# EasyEDA Pro project FPGA_oscilloscope Analog pre circuit PCB.epro

# Schematic Schematic1
Create Date: 2024-04-10; Page Name: P1; Project Name: 示波器前置电路; Schematic Name: Schematic1; Update Date: 2024-04-10; Company: 嘉立创EDA; Page Size: A4; Version: V1.0
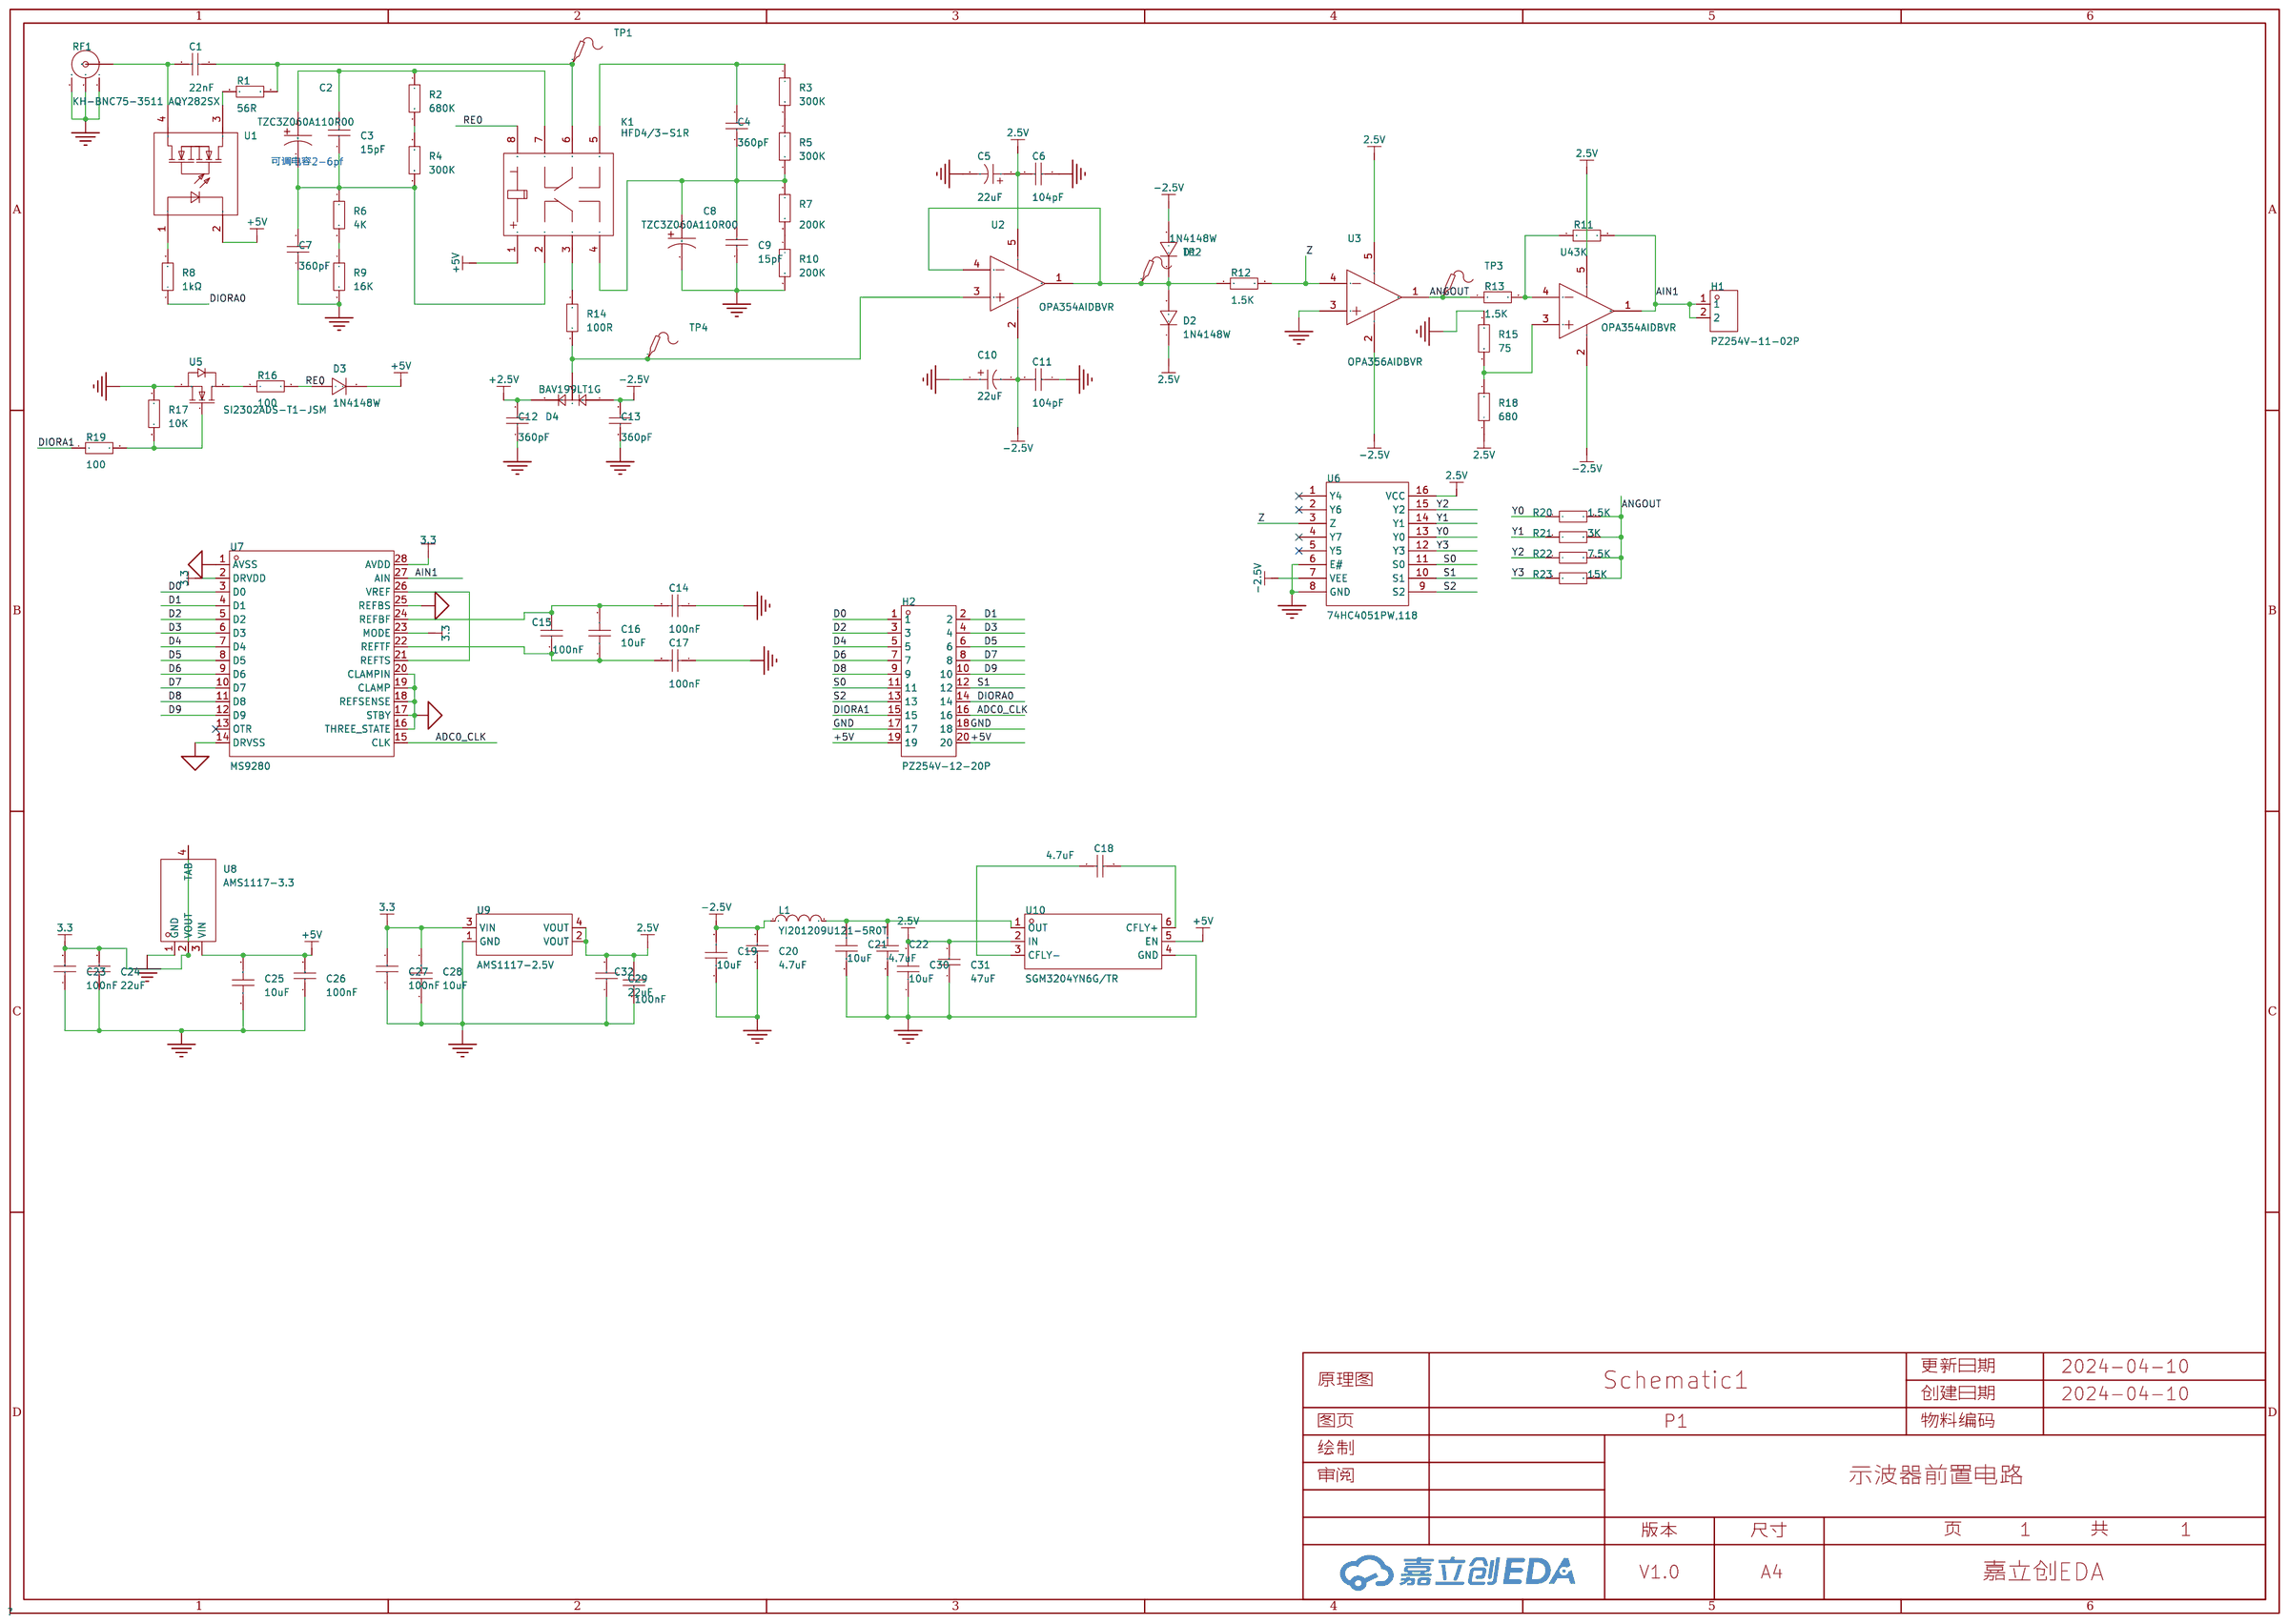
[diagram p0: schematic sheet]

## Parts
C1  22nF  [C1206]
C2  TZC3Z060A110R00  [CAP-SMD_L4.50-W3.20]
C3  15pF  [C0805]
C4  360pF  [C0805]
C5  22uF  [CAP-SMD_BD4.0-L4.3-W4.3-FD-A]
C6  104pF  [C0805]
C7  360pF  [C0805]
C8  TZC3Z060A110R00  [CAP-SMD_L4.50-W3.20]
C9  15pF  [C0805]
C10  22uF  [CAP-SMD_BD4.0-L4.3-W4.3-FD-A]
C11  104pF  [C0805]
C12  360pF  [C0805]
C13  360pF  [C0805]
C14  100nF  [C0805]
C15  100nF  [C0805]
C16  10uF  [C0805]
C17  100nF  [C0805]
C18  4.7uF  [C0805]
C19  10uF  [C0805]
C20  4.7uF  [C0805]
C21  10uF  [C0805]
C22  4.7uF  [C0805]
C23  100nF  [C0805]
C24  22uF  [C0805]
C25  10uF  [C0805]
C26  100nF  [C0805]
C27  100nF  [C0805]
C28  10uF  [C0805]
C29  22uF  [C0805]
C30  10uF  [C0805]
C31  47uF  [C0805]
C32  100nF  [C0805]
D1  1N4148W  [SOD-123_L2.8-W1.8-LS3.7-RD]
D2  1N4148W  [SOD-123_L2.8-W1.8-LS3.7-RD]
D3  1N4148W  [SOD-123_L2.8-W1.8-LS3.7-RD]
D4  BAV199LT1G  [SOT-23_L2.9-W1.3-P1.90-LS2.4-BR]
H1  PZ254V-11-02P  [HDR-TH_2P-P2.54-V-M]
H2  PZ254V-12-20P  [HDR-TH_20P-P2.54-V-M-R2-C10-S2.54]
K1  HFD4/3-S1R  [RELAY-SMD_HFD4-3-S1R]
L1  YI201209U121-5R0T  [L0805]
R1  56R  [R0805]
R2  680K  [R0805]
R3  47K  [R0805]
R4  300K  [R0805]
R5  300K  [R0805]
R6  47K  [R0805]
R7  200K  [R0805]
R8  1kΩ  [R0805]
R9  47K  [R0805]
R10  200K  [R0805]
R11  3K  [R0805]
R12  1.5K  [R0805]
R13  1.5K  [R0805]
R14  100R  [R0805]
R15  75  [R0805]
R16  47K  [R0805]
R17  47K  [R0805]
R18  680  [R0805]
R19  47K  [R0805]
R20  1.5K  [R0805]
R21  3K  [R0805]
R22  7.5K  [R0805]
R23  15K  [R0805]
RF1  KH-BNC75-3511  [ANT-TH_KH-BNC75-3511]
TP1  -  [Test-Point-0.5mm]
TP2  -  [Test-Point-0.5mm]
TP3  -  [Test-Point-0.5mm]
TP4  -  [Test-Point-0.5mm]
U1  AQY282SX  [SOP-4_L4.3-W4.4-P2.54-LS7.0-BL]
U2  OPA354AIDBVR  [SOT-23-5_L3.0-W1.7-P0.95-LS2.8-BR]
U3  OPA356AIDBVR  [SOT-23-5_L3.0-W1.7-P0.95-LS2.8-BR]
U4  OPA354AIDBVR  [SOT-23-5_L3.0-W1.7-P0.95-LS2.8-BR]
U5  SI2302ADS-T1-JSM  [SOT-23-3_L2.9-W1.3-P1.90-LS2.4-BR]
U6  74HC4051PW,118  [TSSOP-16_L5.0-W4.4-P0.65-LS6.4-BL]
U7  MS9280  [SSOP-28_L10.2-W5.3-P0.65-LS7.8-BL]
U8  AMS1117-3.3  [SOT-223-3_L6.5-W3.5-P3.05-LS7.0]
U9  AMS1117-2.5V  [SOT-223_L6.5-W3.5-P2.30-LS7.0-BR]
U10  SGM3204YN6G/TR  [SOT-23-6_L2.9-W1.6-P0.95-LS2.8-BR]

## Library data of the parts
C1 = GRM3195C1H223JA01D: 容值:22nF;精度:±5%;额定电压:50V;材质(温度系数):C0G;; LCSC Part Name: 22nF ±5% 50V; Supplier Part: C97929; Manufacturer: muRata(村田); Supplier Footprint: 1206; JLCPCB Part Class: 扩展库; Datasheet: https://atta.szlcsc.com/upload/public/pdf/source/20180228/C97929_15198056796321377690.pdf; Supplier: LCSC; Tolerance: ±5%; Voltage Rated: 50V; Temperature Coefficient: C0G
C2 C8 = TZC3Z060A110R00: 静电容量:2pF~6pF;静电容量公差:0%~+50%;额定电压(Vdc):100V;Q值:500@1MHz;; LCSC Part Name: 2pF~6pF 100V; Supplier Part: C98107; Manufacturer: muRata(村田); Supplier Footprint: SMD,4.5x3.2mm; JLCPCB Part Class: 扩展库; Datasheet: https://atta.szlcsc.com/upload/public/pdf/source/20190613/C98107_4E252F435657FA4638F4846F0BD190EF.pdf; Supplier: LCSC; electrostatic capacity: 2pF~6pF; Tolerance: 0%~+50%; Rated Voltage: 100V; Q @ Freq: 500@1MHz; Operating Temperature: -25℃~+85℃
C3 C4 C6 C7 C9 C11-C13 = CL21B105KBFNNNE: 容值:1uF;精度:±10%;额定电压:50V;材质(温度系数):X7R;; LCSC Part Name: 1uF ±10% 50V; Supplier Part: C28323; Manufacturer: SAMSUNG(三星); Supplier Footprint: 0805; JLCPCB Part Class: 基础库; Datasheet: https://atta.szlcsc.com/upload/public/pdf/source/20160218/1457707763339.pdf; Supplier: LCSC; Tolerance: ±10%; Voltage Rated: 50V; Temperature Coefficient: X7R
C5 C10 = RVT22UF16V67RV0017: 容值:22uF;精度:±20%;额定电压:16V;纹波电流:21mA@120Hz;等效串联电阻:-;; LCSC Part Name: 22uF ±20% 16V; Supplier Part: C2895280; Manufacturer: KNSCHA(科尼盛); Supplier Footprint: SMD,D4xL5.4mm; JLCPCB Part Class: 扩展库; Datasheet: https://atta.szlcsc.com/upload/public/pdf/source/20210913/F3045483CFF837C1D63EB135475AA9CE.pdf; Supplier: LCSC; Tolerance: ±20%; Rated Voltage: 16V; Ripple Current: 21mA@120Hz; φD: 4mm; L: 5.4mm; Lifetime @ Temp: 2000hrs@105℃; Operating Temperature: -55℃~+105℃
C14 C15 C17 C18 C20 C23 C24 C26 C27 C29 C31 C32 = 0805B104K500NT: 容值:100nF;精度:±10%;额定电压:50V;材质(温度系数):X7R;; LCSC Part Name: 100nF ±10% 50V; Supplier Part: C38141; Manufacturer: FH(风华); Supplier Footprint: 0805; JLCPCB Part Class: 扩展库; Datasheet: https://atta.szlcsc.com/upload/public/pdf/source/20200305/C486355_26A10D38EF8C2A5C37091D0039909270.pdf; Supplier: LCSC; Tolerance: ±10%; Voltage Rated: 50V; Temperature Coefficient: X7R
C16 C19 C21 C22 C25 C28 C30 = CL21A106KAYNNNE_C15850: 容值:10uF;精度:±10%;额定电压:25V;材质(温度系数):X5R;; LCSC Part Name: 10uF ±10% 25V; Supplier Part: C15850; Manufacturer: SAMSUNG(三星); Manufacturer Part: CL21A106KAYNNNE; Supplier Footprint: 0805; JLCPCB Part Class: 基础库; Datasheet: https://atta.szlcsc.com/upload/public/pdf/source/20160218/1457707763339.pdf; Supplier: LCSC; Tolerance: ±10%; Voltage Rated: 25V; Temperature Coefficient: X5R
D1-D3 = 1N4148W_C2099: 二极管配置:独立式;正向压降(Vf):1.25V@150mA;直流反向耐压(Vr):100V;平均整流电流(Io):150mA;功率:500mW;反向恢复时间(trr):4ns;; LCSC Part Name: 电压:100V 电流:150mA; Supplier Part: C2099; Manufacturer: CJ(江苏长电/长晶); Supplier Footprint: SOD-123; JLCPCB Part Class: 扩展库; Datasheet: https://atta.szlcsc.com/upload/public/pdf/source/20120428/1457706480199.pdf; Supplier: LCSC; Diode Configuration: 独立式; Forward Voltage (Vf@If): 1.25V@150mA; Reverse Voltage (Vr): 100V; Average Rectified Current (Io): 150mA; Power Dissipation: 500mW; Reverse Leakage Current: 1uA@75V; Reverse Recovery Time (trr): 4ns
D4 = BAV199LT1G: 二极管配置:1对串联式;正向压降(Vf):1.25V@150mA;直流反向耐压(Vr):70V;平均整流电流(Io):215mA;; LCSC Part Name: 电压:70V 电流:215mA; Supplier Part: C145516; Manufacturer: onsemi(安森美); Supplier Footprint: SOT-23; JLCPCB Part Class: 扩展库; Datasheet: https://atta.szlcsc.com/upload/public/pdf/source/20180112/C145516_15157255405661261285.PDF; Supplier: LCSC; Diode Configuration: 1对串联式; Forward Voltage (Vf@If): 1.25V@150mA; Reverse Voltage (Vr): 70V; Average Rectified Current (Io): 215mA; Reverse Leakage Current: 5uA@70V
H1 = PZ254V-11-02P: 插针结构:1x2P;间距:2.54mm;行距:-;圆针/方针:方针;安装类型:直插;排数:单排;总PIN位数:2P;额定电流:-;额定电压:-;配合针长度:6mm;塑高:2.5mm;端接针长度:3mm;触头材质:黄铜;触头镀层:-;工作温度范围:-40℃~+105℃;颜色:黑色;; LCSC Part Name: 间距:2.54mm 1x2P 直插 方针; Supplier Part: C492401; Manufacturer: XFCN(兴飞); Supplier Footprint: 插件,P=2.54mm; JLCPCB Part Class: 扩展库; Datasheet: https://atta.szlcsc.com/upload/public/pdf/source/20200309/C492401_A812433581A9B211A7FFA413ADDFF0E5.pdf; Supplier: LCSC; Pin Structure: 1x2P; Pitch: 2.54mm; Circluar Pins/Square Pins: 方针; Mounting Type: 直插; Number of Rows: 单排; Number of Pins: 2P; Length of Mating Pin: 6mm; Insulation Height: 2.5mm; Length of End Connection Pin: 3mm; Contact Material: 黄铜; Operating Temperature Range: -40℃~+105℃; Color: 黑色
H2 = PZ254V-12-20P: 插针结构:2x10P;间距:2.54mm;行距:2.54mm;圆针/方针:方针;安装类型:直插;排数:双排;总PIN位数:20P;额定电流:-;额定电压:-;配合针长度:6mm;塑高:2.5mm;端接针长度:3mm;触头材质:黄铜;触头镀层:-;工作温度范围:-40℃~+105℃;颜色:黑色;; LCSC Part Name: 间距:2.54mm 2x10P 直插 方针; Supplier Part: C492427; Manufacturer: XFCN(兴飞); Supplier Footprint: 插件,P=2.54mm; JLCPCB Part Class: 扩展库; Datasheet: https://atta.szlcsc.com/upload/public/pdf/source/20200309/C492427_9411E93D35F2EC20CED9A3ED9F4BBE60.pdf; Supplier: LCSC; Pin Structure: 2x10P; Pitch: 2.54mm; Row Spacing: 2.54mm; Circluar Pins/Square Pins: 方针; Mounting Type: 直插; Number of Rows: 双排; Number of Pins: 20P; Length of Mating Pin: 6mm; Insulation Height: 2.5mm; Length of End Connection Pin: 3mm; Contact Material: 黄铜; Operating Temperature Range: -40℃~+105℃; Color: 黑色
K1 = HFD4/3-S1R: 线圈电压:3V;触点形式:两组转换:2C(双刀双掷-转换);触点容量(电阻负载):1A@30VDC；300mA@125VAC;最大切换电压:250V@AC；220V@DC;最大切换电流:2A;; LCSC Part Name: 超小型3V继电器 双刀双掷; Supplier Part: C143232; Manufacturer: HF(宏发); Supplier Footprint: SMD,6.5x10mm; JLCPCB Part Class: 扩展库; Supplier: LCSC; Coil Voltage: 3V; Contact Form: 两组转换:2C(双刀双掷-转换); Pin Number: 8; Contact Rating: 1A@30VDC；300mA@125VAC; Maximum Switching Voltage: 250V@AC；220V@DC; Contact Material: AgNi+镀金; Coil Rated Power: 140mW; Coil Resistance: 64.3Ω; Maximum Switching Current: 2A; Operate Time: 3ms; Release Time: 3ms; Coil Type: 有极性-单线圈; Contact Resistance: 100mΩ; Operating Temperature: -40℃~+85℃
L1 = YI201209U121-5R0T: 标称阻抗@测试频率:120Ω@100MHz;误差:±25%;直流电阻(RDC):30mΩ;; LCSC Part Name: 0805磁珠 阻抗120Ω@100MHz; Supplier Part: C2971889; Manufacturer: YJYCOIN(益嘉源); Supplier Footprint: 0805; JLCPCB Part Class: 扩展库; Datasheet: https://atta.szlcsc.com/upload/public/pdf/source/20220124/0B82DFBCB0ECDB082B32D6E52BFF1CFB.pdf; Supplier: LCSC; Impedance @ Frequency: 120Ω@100MHz; Tolerance: ±25%; DC Resistance: 30mΩ; Current Rating: 5A
R1-R23 = 0805W8F1001T5E: 电阻类型:厚膜电阻;阻值:1kΩ;精度:±1%;功率:125mW;最大工作电压:150V;温度系数:±100ppm/℃;; LCSC Part Name: 1kΩ ±1% 125mW 厚膜电阻; Supplier Part: C17513; Manufacturer: UNI-ROYAL(厚声); Supplier Footprint: 0805; JLCPCB Part Class: 基础库; Datasheet: https://atta.szlcsc.com/upload/public/pdf/source/20200306/C422600_1E6D84923E4A46A82E41ADD87F860B5C.pdf; Supplier: LCSC; Type: 厚膜电阻; Tolerance: ±1%; Power(Watts): 125mW; Overload Voltage (Max): 150V; Temperature Coefficient: ±100ppm/℃; Operating Temperature Range: -55℃~+155℃
RF1 = KH-BNC75-3511: 连接器类型:板端;接口类型:内孔;端口数量:1;接口直径:9.5mm;接口长度/高度:-;频率-最大值:3GHz;射频系列:BNC;阻抗:75Ω;样式:弯头;工作温度范围:-55℃~+155℃;; LCSC Part Name: BNC 内孔 弯头; Supplier Part: C2837588; Manufacturer: kinghelm(金航标); Supplier Footprint: 插件; JLCPCB Part Class: 扩展库; Datasheet: https://atta.szlcsc.com/upload/public/pdf/source/20221123/107886A8942993FCB0C00E519661A2AA.pdf; Supplier: LCSC; Connector Type: 板端; Interface Type: 内孔; Number of Ports: 1; Interface Diameter: 9.5mm; Frequency-Max: 3GHz; RF Series: BNC; Impedance: 75Ω; Style: 弯头; Operating Temperature Range: -55℃~+155℃
TP1-TP4 = Test-Point: Test Point 测试点
U1 = AQY282SX: 继电器触点形式:1 Form A(SPST-NO);适用负载类型:AC,DC;正向压降:1.14V;负载电压:60V;连续负载电流:500mA;导通电阻:850mΩ;; LCSC Part Name: 1 Form A(SPSTNO) 负载AC,DC 负载电压60V; Supplier Part: C250827; Manufacturer: PANASONIC(松下); Supplier Footprint: SOP-4-2.54mm; JLCPCB Part Class: 扩展库; Datasheet: https://atta.szlcsc.com/upload/public/pdf/source/20191104/C443818_6B9110F31C59FBA60B0CFD8E57AA94AC.pdf; Supplier: LCSC; Relay Contact Form: 1 Form A(SPST-NO); Load Type: AC,DC; Input Forward Voltage: 1.14V; Voltage - Load: 60V; Continuous Load Current: 500mA; On Resistance: 850mΩ; Isolation Voltage(rms): 1.5kV; Turn-on time: 900us; Turn-off time: 500us
U2 U4 = OPA354AIDBVR: 放大器数:单路;增益带宽积(GBP):100MHz;输入偏置电流(Ib):3pA;输入失调电压(Vos):2mV;压摆率(SR):150V/us;带宽(-3db):250MHz;轨到轨:-;; Supplier Part: C36384; Manufacturer: TI(德州仪器); Supplier Footprint: SOT-23-5; JLCPCB Part Class: 扩展库; Datasheet: https://www.ti.com/cn/lit/gpn/opa354; Supplier: LCSC; Number of Circuits: 单路; Gain Bandwidth Product(GBP): 100MHz; Current - Input Bias(Ib): 3pA; Voltage - Input Offset(Vos): 2mV; Slew Rate(SR): 150V/us; Output Current: 100mA; -3db Bandwidth: 250MHz; Supply Current: 4.9mA; Operating Temperature: -40℃~+125℃
U3 = OPA356AIDBVR: 放大器数:单路;增益带宽积(GBP):200MHz;输入偏置电流(Ib):3pA;压摆率(SR):360V/us;带宽(-3db):450MHz;轨到轨:-;; Supplier Part: C183100; Manufacturer: TI(德州仪器); Supplier Footprint: SOT-23-5; JLCPCB Part Class: 扩展库; Datasheet: https://www.ti.com/cn/lit/gpn/opa356; Supplier: LCSC; Number of Circuits: 单路; Gain Bandwidth Product(GBP): 200MHz; Current - Input Bias(Ib): 3pA; Slew Rate(SR): 360V/us; Output Current: 100mA; -3db Bandwidth: 450MHz; Operating Temperature: -40℃~+125℃
U5 = SI2302ADS-T1-JSM: Supplier Part: C6533558; Manufacturer: JSMSEMI(杰盛微); Supplier Footprint: SOT-23-3; JLCPCB Part Class: 扩展库; Datasheet: https://atta.szlcsc.com/upload/public/pdf/source/20230612/FFE5D426B922876E1ACE369FE8401F3F.pdf; Supplier: LCSC
U6 = 74HC4051PW,118: 通道数:1;导通电阻(Ron@VCC):120Ω;; Supplier Part: C5645; Manufacturer: Nexperia(安世); Supplier Footprint: TSSOP-16; JLCPCB Part Class: 扩展库; Datasheet: https://atta.szlcsc.com/upload/public/pdf/source/20120413/1457706470089.pdf; Supplier: LCSC; Number of Channels: 1; Supply Voltage: 2V~10V; Turn-on time: 51ns; On-State Resistance (Max): 120Ω; Turn-off time: 42ns
U7 = MS9280: 接口:并行;电源电压:2.7V~5.5V;采样率:35MHz;分辨率:10位;; LCSC Part Name: 1通道 50MHz 10位ADC 并行接口; Supplier Part: C1509021; Manufacturer: 杭州瑞盟; Supplier Footprint: SSOP-28-208mil; JLCPCB Part Class: 扩展库; Datasheet: https://atta.szlcsc.com/upload/public/pdf/source/20231007/DECFDB597B151F846156A5BCFBCA36B2.pdf; Supplier: LCSC; Interface: 并行; number of channels: 1; Supply Voltage: 2.7V~5.5V; sampling frequency: 35MHz; resolution: 10位
U8 = AMS1117-3.3_C5250992: 输出类型：固定 输出极性：正 最大输入电压：18V 输出电压：3.3V 输出电流：1A 电源纹波抑制比(PSRR)：60dB@(120Hz)。当前应用较多领域：三端稳压器，机顶盒; Supplier Part: C5250992; Manufacturer: TWGMC(台湾迪嘉); Supplier Footprint: SOT-223-3L; JLCPCB Part Class: 扩展库; Datasheet: https://atta.szlcsc.com/upload/public/pdf/source/20221109/A58A92B07670E85D28928AE371260E8D.pdf; Supplier: LCSC
U9 = AMS1117-2.5V_1: 输出类型:固定;最大输入电压:18V;输出电压:2.5V;最大输出电流:1A;电源纹波抑制比(PSRR):60dB@(120Hz);输出极性:正极;; LCSC Part Name: 正 Vin=18V Vout=2.5V 1A 60dB@(120Hz); Supplier Part: C5240656; Manufacturer: MSKSEMI(美森科); Supplier Footprint: SOT-223; JLCPCB Part Class: 扩展库; Datasheet: https://atta.szlcsc.com/upload/public/pdf/source/20230802/7000FCAFF33971783A269E7BD69EFE08.pdf; Supplier: LCSC; Output Type: 固定; Maximum Input Voltage: 18V; Output Voltage: 2.5V; MAX Output Current: 1A; Power Supply Rejection Ratio (PSRR): 60dB@(120Hz); Dropout Voltage: 1.3V@(1A); Output Polarity: 正极
U10 = SGM3204YN6G/TR: 功能类型:-;输入电压:1.4V~5.5V;输出电压:-5.5V~-1.4V;输出电流(最大值):200mA;; Supplier Part: C194031; Manufacturer: SGMICRO(圣邦微); Supplier Footprint: SOT-23-6; JLCPCB Part Class: 扩展库; Datasheet: https://atta.szlcsc.com/upload/public/pdf/source/20180627/C194031_755051E53122D645C36CF727711B963E.pdf; Supplier: LCSC; Input Voltage: 1.4V~5.5V; Output Voltage: -5.5V~-1.4V; Output Current (Max): 200mA; Switching Frequency: 950kHz; Number of Outputs: 1; Switch tube (built-in/external): 内置

## Nets
2.5V: C5.1 C6.2 C29.2 C30.2 C31.2 C32.2 D2.1(K) R18.1 U2.5(V+) U3.5(V+) U4.5(V+) U6.16(VCC) U9.2(VOUT) U9.4(VOUT) U10.2(IN)
+2.5V: C12.2 D4.2(C)
+5V: C25.2 C26.2 D3.1(K) H2.19 H2.20 K1.1 U1.2 U8.3(VIN) U10.5(EN)
-2.5V: C10.2 C11.2 C13.2 C19.2 C20.2 D1.2(A) D4.1(A) L1.1 U2.2(V-) U3.2(V-) U4.2(V-) U6.7(VEE)
AGND: U7.1(AVSS) U7.14(DRVSS) U7.16(THREE_STATE) U7.17(STBY) U7.18(REFSENSE) U7.19(CLAMP) U7.20(CLAMPIN) U7.25(REFBS)
GND: C5.2 C6.1 C7.1 C8.2 C9.1 C10.1 C11.1 C12.1 C13.1 C14.1 C17.1 C19.1 C20.1 C21.1 C22.1 C23.1 C24.1 C25.1 C26.1 C27.1 C28.1 C29.1 C30.1 C31.1 C32.1 H2.17 H2.18 R9.2 R10.2 R15.2 R17.1 RF1.2 RF1.3 RF1.4 U3.3(IN+) U5.2(S) U6.6(E#) U6.8(GND) U8.1(GND) U9.1(GND) U10.4(GND)
3.3: C23.2 C24.2 C27.2 C28.2 U7.2(DRVDD) U7.23(MODE) U7.28(AVDD) U8.2(VOUT) U8.4(TAB) U9.3(VIN)
ADC0_CLK: H2.16 U7.15(CLK)
AIN1: H1.1 H1.2 R11.2 U4.1(OUT) U7.27(AIN)
ANGOUT: R13.1 R20.2 R21.2 R22.2 R23.2 TP3.1 U3.1(OUT)
D0: H2.1 U7.3(D0)
D1: H2.2 U7.4(D1)
D2: H2.3 U7.5(D2)
D3: H2.4 U7.6(D3)
D4: H2.5 U7.7(D4)
D5: H2.6 U7.8(D5)
D6: H2.7 U7.9(D6)
D7: H2.8 U7.10(D7)
D8: H2.9 U7.11(D8)
D9: H2.10 U7.12(D9)
DIORA0: H2.14 R8.1
DIORA1: H2.15 R19.1
RE0: D3.2(A) K1.8 R16.2
S0: H2.11 U6.11(S0)
S1: H2.12 U6.10(S1)
S2: H2.13 U6.9(S2)
Y0: R20.1 U6.13(Y0)
Y1: R21.1 U6.14(Y1)
Y2: R22.1 U6.15(Y2)
Y3: R23.1 U6.12(Y3)
Z: R12.2 U3.4(IN-) U6.3(Z)
$1N691: C1.1 RF1.1(OUT) U1.4
$1N811: R8.2 U1.1
$1N857: R1.2 U1.3
$1N871: C1.2 K1.6 R1.1 TP1.1
$1N1249: C2.1 C3.2 K1.7 R2.1
$1N1320: K1.3 R14.1
$1N1547: C2.2 C3.1 C7.2 K1.2 R4.2 R6.1
$1N1899: R17.2 R19.2 U5.1(G)
$1N2058: R16.1 U5.3(D)
$1N2253: D4.3(C/A) R14.2 TP4.1 U2.3(IN+)
$1N6224: R6.2 R9.1
$1N6262: R2.2 R4.1
$1N6325: C4.2 K1.5 R3.1
$1N6377: R3.2 R5.1
$1N6535: R7.2 R10.1
$1N6629: D1.1(K) D2.2(A) R12.1 TP2.1 U2.1(OUT) U2.4(IN-)
$1N7875: R11.1 R13.2 U4.4(IN-)
$1N8016: R15.1 R18.2 U4.3(IN+)
$1N8606: U7.21(REFTS) U7.26(VREF)
$1N17008: C21.2 C22.2 L1.2 U10.1(OUT)
$1N17602: C14.2 C15.2 C16.2 U7.24(REFBF)
$1N17632: C15.1 C16.1 C17.2 U7.22(REFTF)
$1N20744: C18.1 U10.6(CFLY+)
$1N20751: C18.2 U10.3(CFLY-)
$1N20802: C4.1 C8.1 C9.2 K1.4 R5.2 R7.1

Not connected (* = marked no-connect by the designer): U6 1(Y4)* 2(Y6)* 4(Y7)* 5(Y5)*; U7 13(OTR)*

## Notes on the sheet
- 可调电容2-6pf

# Board PCB1
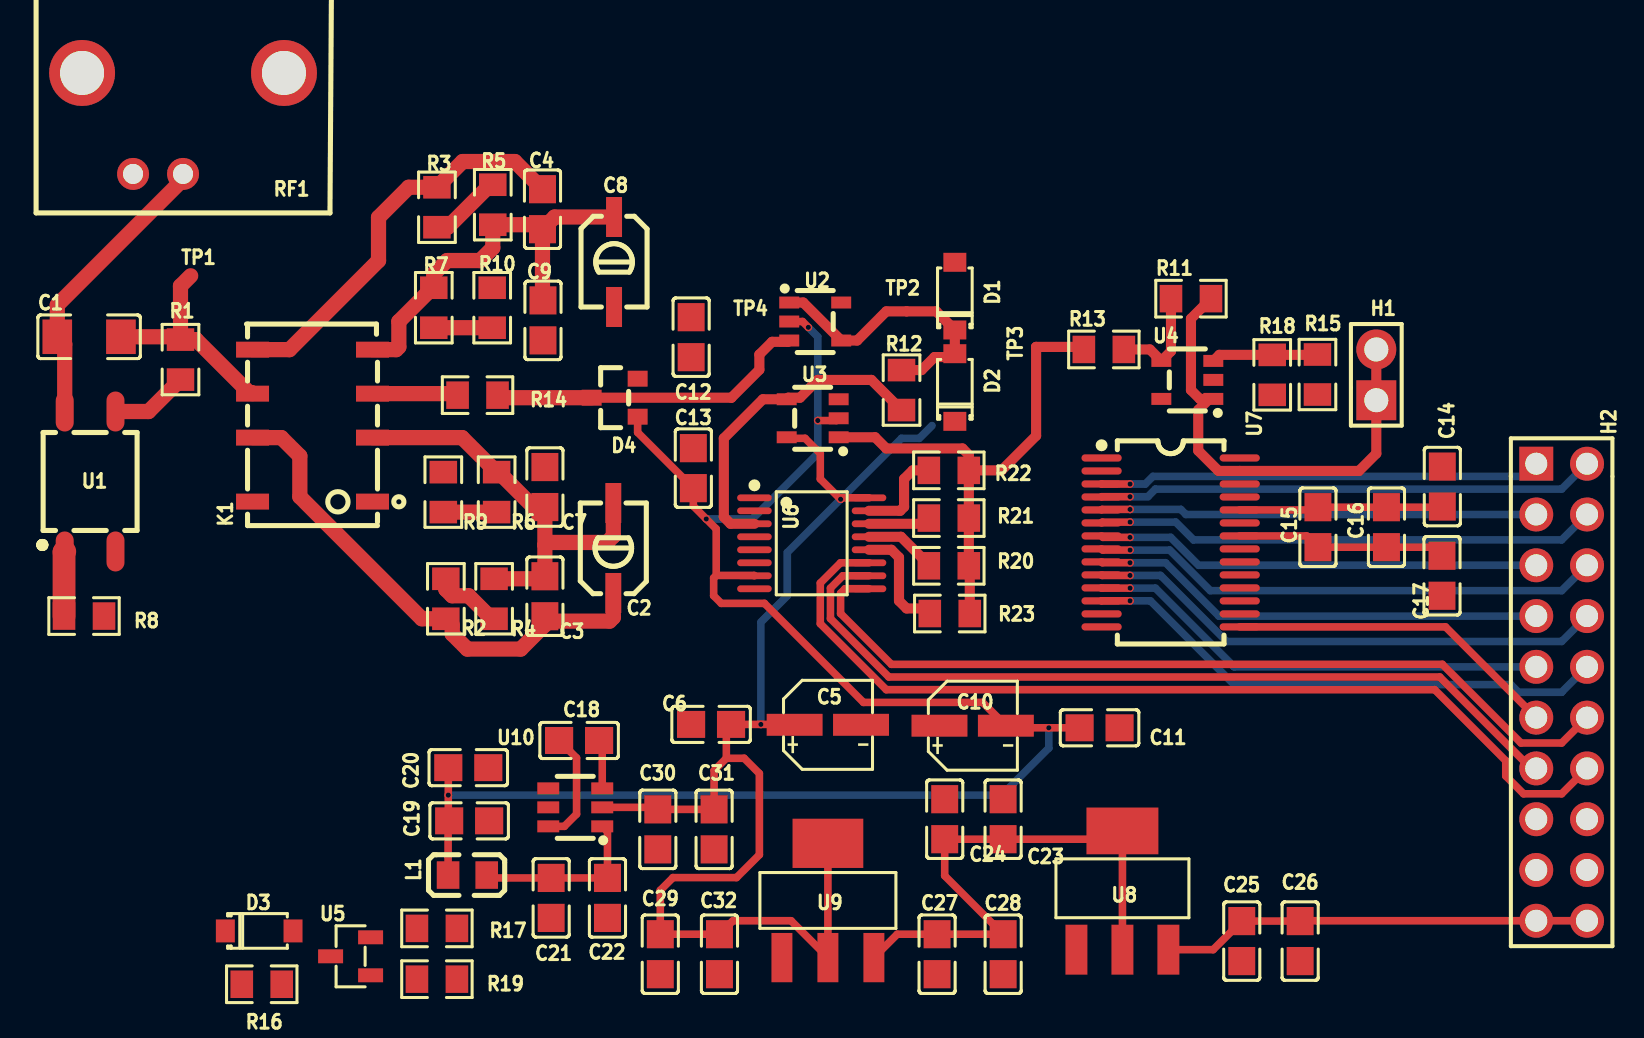
[diagram p1: board, top side]
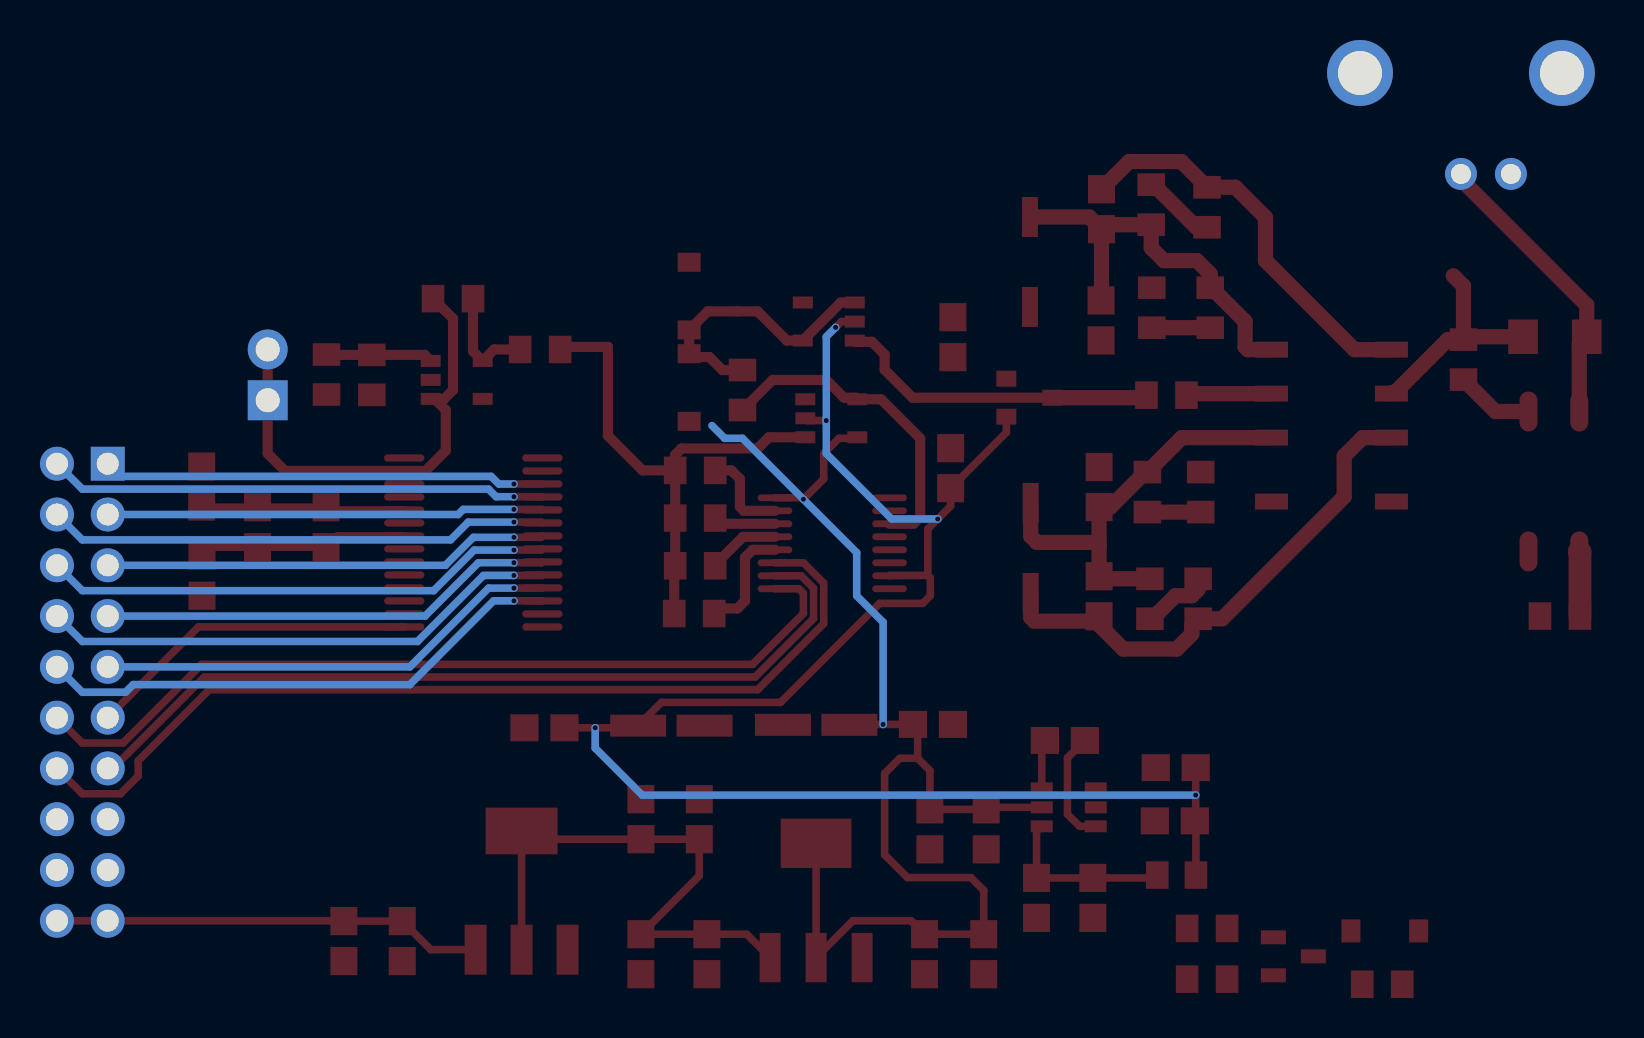
[diagram p2: board, bottom side, seen from below]

No outline. copper layers: Top Layer, Bottom Layer. Coordinates in mm from the lowest, leftmost part position.
Stack: Top Layer 0.035mm / Dielectric1 1.51mm FR4 er 4.5 / Bottom Layer 0.035mm

## Design rules (mm)
template: 自定义配置
spacing copperThickness1oz (default): track to track 0.102, other pairs 0.152 to 0.3
spacing copperThickness2oz: track to track 0.203, other pairs 0.152 to 0.3
track width copperThickness1oz (default): min 0.127, default 0.254, max 2.54
track width copperThickness2oz: min 0.203, default 0.254, max 2.54
differential pair differentialPair (default): width min 0.127, default 0.254, max 2.54; gap min 0.152, default 0.152
via viaSize (default): diameter min 0.356, default 0.61, max 10; hole min 0.229, default 0.305, max 6.299

## Placement (name value [footprint] x y rotation side)
C1  22nF  [C1206]  0.25 32.39 0 top
C2  TZC3Z060A110R00  [CAP-SMD_L4.50-W3.20]  26.48 21.82 90 top
C3  15pF  [C0805]  23.05 19.41 270 top
C4  360pF  [C0805]  22.93 38.76 90 top
C5  22uF  [CAP-SMD_BD4.0-L4.3-W4.3-FD-A]  37.21 12.98 0 top
C6  104pF  [C0805]  31.37 13 0 top
C7  360pF  [C0805]  23.05 24.87 270 top
C8  TZC3Z060A110R00  [CAP-SMD_L4.50-W3.20]  26.51 36.12 270 top
C9  15pF  [C0805]  22.96 33.2 90 top
C10  22uF  [CAP-SMD_BD4.0-L4.3-W4.3-FD-A]  44.45 12.93 0 top
C11  104pF  [C0805]  50.8 12.83 180 top
C12  360pF  [C0805]  30.37 32.36 90 top
C13  360pF  [C0805]  30.48 25.81 270 top
C14  100nF  [C0805]  67.94 24.89 270 top
C15  100nF  [C0805]  61.72 22.86 90 top
C16  10uF  [C0805]  65.15 22.86 90 top
C17  100nF  [C0805]  67.93 20.43 90 top
C18  4.7uF  [C0805]  24.76 12.19 0 top
C19  10uF  [C0805]  19.27 8.17 180 top
C20  4.7uF  [C0805]  19.22 10.83 180 top
C21  10uF  [C0805]  23.37 4.32 90 top
C22  4.7uF  [C0805]  26.18 4.32 90 top
C23  100nF  [C0805]  45.97 8.25 270 top
C24  22uF  [C0805]  43.05 8.25 270 top
C25  10uF  [C0805]  57.91 2.16 90 top
C26  100nF  [C0805]  60.83 2.16 90 top
C27  100nF  [C0805]  42.67 1.5 90 top
C28  10uF  [C0805]  45.98 1.5 90 top
C29  22uF  [C0805]  28.83 1.5 90 top
C30  10uF  [C0805]  28.7 7.75 90 top
C31  47uF  [C0805]  31.52 7.75 90 top
C32  100nF  [C0805]  31.79 1.5 90 top
D1  1N4148W  [SOD-123_L2.8-W1.8-LS3.7-RD]  43.56 34.42 90 top
D2  1N4148W  [SOD-123_L2.8-W1.8-LS3.7-RD]  43.56 29.84 90 top
D3  1N4148W  [SOD-123_L2.8-W1.8-LS3.7-RD]  8.76 2.67 0 top
D4  BAV199LT1G  [SOT-23_L2.9-W1.3-P1.90-LS2.4-BR]  26.54 29.34 0 top
H1  PZ254V-11-02P  [HDR-TH_2P-P2.54-V-M]  64.64 30.48 90 top
H2  PZ254V-12-20P  [HDR-TH_20P-P2.54-V-M-R2-C10-S2.54]  73.91 14.6 270 top
K1  HFD4/3-S1R  [RELAY-SMD_HFD4-3-S1R]  11.43 27.94 90 top
L1  YI201209U121-5R0T  [L0805]  19.18 5.46 0 top
R1  56R  [R0805]  4.83 31.24 270 top
R2  680K  [R0805]  18.1 19.28 90 top
R3  47K  [R0805]  17.65 38.86 270 top
R4  300K  [R0805]  20.51 19.28 90 top
R5  300K  [R0805]  20.45 38.99 270 top
R6  47K  [R0805]  20.64 24.61 270 top
R7  200K  [R0805]  17.5 33.84 270 top
R8  1kΩ  [R0805]  0 18.41 180 top
R9  47K  [R0805]  17.97 24.61 90 top
R10  200K  [R0805]  20.42 33.84 90 top
R11  3K  [R0805]  55.37 34.29 0 top
R12  1.5K  [R0805]  40.89 29.72 270 top
R13  1.5K  [R0805]  51.01 31.75 0 top
R14  100R  [R0805]  19.69 29.46 0 top
R15  75  [R0805]  61.7 30.5 270 top
R16  47K  [R0805]  8.89 0 180 top
R17  47K  [R0805]  17.65 2.79 180 top
R18  680  [R0805]  59.44 30.48 90 top
R19  47K  [R0805]  17.65 0.25 180 top
R20  1.5K  [R0805]  43.26 20.93 0 top
R21  3K  [R0805]  43.26 23.32 0 top
R22  7.5K  [R0805]  43.26 25.7 0 top
R23  15K  [R0805]  43.31 18.54 0 top
RF1  KH-BNC75-3511  [ANT-TH_KH-BNC75-3511]  4.95 43.05 180 top
TP1  -  [Test-Point-0.5mm]  5.33 35.43 0 top
TP2  -  [Test-Point-0.5mm]  41.15 33.66 0 top
TP3  -  [Test-Point-0.5mm]  47.62 31.88 0 top
TP4  -  [Test-Point-0.5mm]  32.38 29.34 0 top
U1  AQY282SX  [SOP-4_L4.3-W4.4-P2.54-LS7.0-BL]  0.3 25.15 0 top
U2  OPA354AIDBVR  [SOT-23-5_L3.0-W1.7-P0.95-LS2.8-BR]  36.58 33.15 180 top
U3  OPA356AIDBVR  [SOT-23-5_L3.0-W1.7-P0.95-LS2.8-BR]  36.45 28.31 0 top
U4  OPA354AIDBVR  [SOT-23-5_L3.0-W1.7-P0.95-LS2.8-BR]  55.19 30.23 0 top
U5  SI2302ADS-T1-JSM  [SOT-23-3_L2.9-W1.3-P1.90-LS2.4-BR]  13.34 1.4 0 top
U6  74HC4051PW,118  [TSSOP-16_L5.0-W4.4-P0.65-LS6.4-BL]  36.4 22.06 270 top
U7  MS9280  [SSOP-28_L10.2-W5.3-P0.65-LS7.8-BL]  54.36 22.1 270 top
U8  AMS1117-3.3  [SOT-223-3_L6.5-W3.5-P3.05-LS7.0]  51.94 4.7 270 top
U9  AMS1117-2.5V  [SOT-223_L6.5-W3.5-P2.30-LS7.0-BR]  37.21 4.19 270 top
U10  SGM3204YN6G/TR  [SOT-23-6_L2.9-W1.6-P0.95-LS2.8-BR]  24.57 8.85 0 top

## Footprints (pads in the part's own frame, mm; a bottom-side part is the same pattern mirrored in y, then rotated)
ANT-TH_KH-BNC75-3511
  round 1.6 hole 1: 1(0,2.525) 2(2.5,2.525)
  round 3.3 hole 2.2: 3(5.05,-2.525) 4(-5.05,-2.525)
C0805
  rect 1.41x1.35 smd: 1(-1,0) 2(1,0)
C1206
  rect 1.485x1.728 smd: 1(-1.593,0) 2(1.593,0)
CAP-SMD_BD4.0-L4.3-W4.3-FD-A
  rect 2.8x1.1 smd: 1(-1.661,0) 2(1.661,0)
CAP-SMD_L4.50-W3.20
  rect 2x0.8 smd: 1(-2.25,0) 2(2.25,0)
HDR-TH_2P-P2.54-V-M
  rect 2x2 hole 1.2: 1(-1.27,0)
  round 2 hole 1.2: 2(1.27,0)
HDR-TH_20P-P2.54-V-M-R2-C10-S2.54
  rect 1.7x1.7 hole 1.1: 1(-11.43,-1.27)
  round 1.7 hole 1.1: 2(-11.43,1.27) 3(-8.89,-1.27) 4(-8.89,1.27) 5(-6.35,-1.27) 6(-6.35,1.27) 7(-3.81,-1.27) 8(-3.81,1.27) 9(-1.27,-1.27) 10(-1.27,1.27) 11(1.27,-1.27) 12(1.27,1.27) 13(3.81,-1.27) 14(3.81,1.27) 15(6.35,-1.27) 16(6.35,1.27) 17(8.89,-1.27) 18(8.89,1.27) 19(11.43,-1.27) 20(11.43,1.27)
L0805
  rect 1.133x1.377 smd: 1(-0.966,0) 2(0.966,0)
R0805
  rect 1.133x1.377 smd: 1(-1,0) 2(1,0)
RELAY-SMD_HFD4-3-S1R
  rect 0.8x1.65 smd: 1(-3.8,-3) 2(-0.6,-3) 3(1.6,-3) 4(3.8,-3) 5(3.8,3) 6(1.6,3) 7(-0.6,3) 8(-3.8,3)
SOD-123_L2.8-W1.8-LS3.7-RD
  rect 0.95x1.15 smd: 1(-1.692,0) 2(1.692,0)
SOP-4_L4.3-W4.4-P2.54-LS7.0-BL
  oval 0.9x2 smd: 1(-1.27,-3.5) 2(1.27,-3.5) 3(1.27,3.5) 4(-1.27,3.5)
SOT-23-3_L2.9-W1.3-P1.90-LS2.4-BR
  rect 1.25x0.7 smd: 1(1,-0.95) 2(1,0.95) 3(-1,0)
SOT-23-5_L3.0-W1.7-P0.95-LS2.8-BR
  rect 1x0.6 smd: 1(1.3,-0.95) 2(1.3,0) 3(1.3,0.95) 4(-1.3,0.95) 5(-1.3,-0.95)
SOT-23-6_L2.9-W1.6-P0.95-LS2.8-BR
  rect 1.1x0.6 smd: 1(1.35,-0.95) 2(1.35,0) 3(1.35,0.95) 4(-1.35,0.95) 5(-1.35,0) 6(-1.35,-0.95)
SOT-23_L2.9-W1.3-P1.90-LS2.4-BR
  rect 1x0.8 smd: 1(1.15,-0.95) 2(1.15,0.95) 3(-1.15,0)
SOT-223-3_L6.5-W3.5-P3.05-LS7.0
  rect 2.5x1.1 smd: 1(2.97,-2.3) 2(2.97,0) 3(2.97,2.3)
  rect 2.34x3.6 smd: 4(-2.97,0)
SOT-223_L6.5-W3.5-P2.30-LS7.0-BR
  rect 2.465x1.05 smd: 1(2.857,-2.3) 2(2.857,0) 3(2.857,2.3)
  rect 2.465x3.54 smd: 4(-2.857,0)
SSOP-28_L10.2-W5.3-P0.65-LS7.8-BL
  oval 0.364x2.015 smd: 1(-4.225,-3.455) 2(-3.575,-3.455) 3(-2.925,-3.455) 4(-2.275,-3.455) 5(-1.625,-3.455) 6(-0.975,-3.455) 7(-0.325,-3.455) 8(0.325,-3.455) 9(0.975,-3.455) 10(1.625,-3.455) 11(2.275,-3.455) 12(2.925,-3.455) 13(3.575,-3.455) 14(4.225,-3.455) 15(4.225,3.455) 16(3.575,3.455) 17(2.925,3.455) 18(2.275,3.455) 19(1.625,3.455) 20(0.975,3.455) 21(0.325,3.455) 22(-0.325,3.455) 23(-0.975,3.455) 24(-1.625,3.455) 25(-2.275,3.455) 26(-2.925,3.455) 27(-3.575,3.455) 28(-4.225,3.455)
Test-Point-0.5mm
  round 0.5 smd: 1(0,0)
TSSOP-16_L5.0-W4.4-P0.65-LS6.4-BL
  oval 0.343x1.732 smd: 1(-2.275,-2.866) 2(-1.625,-2.866) 3(-0.975,-2.866) 4(-0.325,-2.866) 5(0.325,-2.866) 6(0.975,-2.866) 7(1.625,-2.866) 8(2.275,-2.866) 9(2.275,2.866) 10(1.625,2.866) 11(0.975,2.866) 12(0.325,2.866) 13(-0.325,2.866) 14(-0.975,2.866) 15(-1.625,2.866) 16(-2.275,2.866)

## Nets
As in the schematic, except:
ADC0_CLK: H2.11 U7.15
DIORA0: H2.16 R8.1
S0: H2.14 U6.11
S1: H2.13 U6.10
S2: H2.12 U6.9

Pads without a net: U6 1 2 4 5; U7 13

## Via types
v1: diameter 0.381, hole 0.254, Top Layer to Bottom Layer, 17 vias

## Routing (per net, layer and track width the routed paths; a pad name or vN(x,y) marks a point on that pad's centre or on a via; arc(x,y) is an arc through that point)
2.5V: length 67.8
  Top Layer w0.381: C5.1 35.52,13 v1(33.86,13) C6.2 32.13,12.76 32.13,11.3 ; 31.52,9.02 31.25,8.75 C30.2 28.6,8.85 U10.2 ; 31.52,9.02 31.52,10.69 32.13,11.3 ; 31.52,9.02 C31.2 ; U6.16 37.92,24.33 v1(37.85,24.26) 36.83,25.27 36.83,26.54 36.07,27.31 35.2,27.31 U3.5 ; U9.4 U9.2 35.37,3.18 32.46,3.18 C32.2 C29.2 28.83,4.7 29.46,5.33 32.64,5.33 33.78,6.48 33.78,10.54 33.02,11.3 32.13,11.3
  Bottom Layer w0.381: 42.42,27.94 41.78,27.31 40.89,27.31 v1(37.85,24.26) 35.18,21.59 35.18,19.43 33.86,18.11 v1(33.86,13)
+5V: length 21.5
  Top Layer w0.381: U8.3 56.48,1.73 C25.2 C26.2 60.85,3.18 75.18,3.18
-2.5V: length 86.7
  Top Layer w0.381: 18.22,8.13 18.21,8.12 L1.1 ; 18.22,8.13 v1(18.22,9.46) C20.2 ; 18.22,8.13 C19.2 ; U3.2 37.63,28.19 v1(36.7,28.19) ; U6.7 33.52,20.45 31.62,20.45 ; C11.2 v1(48.26,12.83) 46.22,12.83 C10.2 44.95,14.1 38.99,14.1 34.04,19.05 31.88,19.05 31.5,19.43 31.5,20.32 31.62,20.45 ; v1(36.23,32.86) 35.94,33.15 U2.2 ; 31.62,20.45 31.62,22.77 v1(31.13,23.27) 30.48,23.92 C13.2 27.69,27.6 D4.1
  Bottom Layer w0.381: v1(48.26,12.83) 48.26,11.81 45.91,9.46 v1(18.22,9.46) ; v1(31.13,23.27) 33.43,23.27 36.7,26.54 v1(36.7,28.19) 36.7,32.39 v1(36.23,32.86)
3.3: length 27.9
  Top Layer w0.381: U9.3 40.68,2.5 C27.2 C28.2 43.05,5.43 C24.2 C23.2 51.53,7.25 U8.4 U8.2
ADC0_CLK: length 16.7
  Top Layer w0.381: 57.81,17.87 68.11,17.87 72.64,13.34
AIN1: length 24
  Top Layer w0.508: 56.49,29.28 56.29,29.28 ; 56.29,29.28 55.74,28.72 55.74,26.69 56.75,25.67 U7.27 63.77,25.67 64.64,26.54 H1.1 H1.2 ; 56.29,29.28 55.81,29.28 55.37,29.72 55.37,33.29 R11.2
ANGOUT: length 25.8
  Top Layer w0.508: R22.2 R21.2 R20.2 44.31,20.88 R23.2 ; R22.2 45.9,25.7 47.62,27.43 TP3.1 49.89,31.88 R13.1 ; R22.2 44.26,26.48 43.94,26.8 40.13,26.8 39.57,27.36 U3.1
D0: length 22.2
  Top Layer w0.381: v1(52.32,25.02) 50.91,25.02 U7.3
  Bottom Layer w0.381: v1(52.32,25.02) 53.09,25.02 53.47,25.4 72.01,25.4 H2.1
D1: length 25
  Top Layer w0.381: 50.9,24.37 50.91,24.38 v1(52.32,24.38)
  Bottom Layer w0.381: v1(52.32,24.38) 53.21,24.38 53.59,24.76 73.91,24.76 H2.2
D2: length 21.9
  Top Layer w0.381: U7.5 50.93,23.75 v1(52.32,23.75)
  Bottom Layer w0.381: v1(52.32,23.75) 54.86,23.75 55.12,23.5 72.64,23.5
D3: length 25.2
  Top Layer w0.381: U7.6 50.94,23.11 v1(52.32,23.11)
  Bottom Layer w0.381: 75.18,23.5 73.91,22.22 55.5,22.22 54.61,23.11 v1(52.32,23.11)
D4: length 22.4
  Top Layer w0.381: v1(52.32,22.35) 50.97,22.35 U7.7
  Bottom Layer w0.381: 72.64,20.96 55.75,20.96 54.36,22.35 v1(52.32,22.35)
D5: length 25.7
  Top Layer w0.381: v1(52.32,21.72) 50.96,21.72 50.9,21.77
  Bottom Layer w0.381: 75.18,20.96 73.91,19.69 56.34,19.69 54.31,21.72 v1(52.32,21.72)
D6: length 22.9
  Top Layer w0.381: U7.9 50.94,21.08 v1(52.32,21.08)
  Bottom Layer w0.381: H2.7 56.77,18.41 54.1,21.08 v1(52.32,21.08)
D7: length 26.2
  Top Layer w0.381: U7.10 50.93,20.45 v1(52.32,20.45)
  Bottom Layer w0.381: H2.8 73.91,17.15 57.15,17.15 53.85,20.45 v1(52.32,20.45)
D8: length 23.4
  Top Layer w0.381: v1(52.32,19.81) 50.91,19.81 U7.11
  Bottom Layer w0.381: v1(52.32,19.81) 53.59,19.81 57.53,15.88 H2.9
D9: length 26.7
  Top Layer w0.381: v1(52.32,19.18) 50.91,19.18 U7.12
  Bottom Layer w0.381: H2.10 73.91,14.6 71.75,14.6 71.37,14.99 57.53,14.99 53.34,19.18 v1(52.32,19.18)
S0: length 47.7
  Top Layer w0.381: U6.11 37.84,21.08 36.83,20.07 36.83,18.03 40.13,14.73 67.56,14.73 71.12,11.18 71.12,10.41 72.01,9.53 73.91,9.53 H2.14
S1: length 42.1
  Top Layer w0.381: U6.10 37.96,20.43 37.34,19.81 37.34,18.29 40.26,15.37 67.82,15.37 72.39,10.79 H2.13
S2: length 43.1
  Top Layer w0.381: 75.18,13.34 73.91,12.06 71.88,12.06 67.94,16 40.39,16 37.85,18.54 37.85,19.56 38.07,19.78 U6.9
Y0: length 3.6
  Top Layer w0.508: R20.1 42.26,20.99 40.87,22.38 U6.13
Y1: length 3.1
  Top Layer w0.508: U6.14 41.97,23.03 R21.1
Y2: length 4.6
  Top Layer w0.508: R22.1 41.45,25.7 41.02,25.27 41.02,23.88 40.83,23.68 U6.15
Y3: length 5.6
  Top Layer w0.508: U6.12 40.39,21.73 40.77,21.35 40.77,19.18 41.15,18.8 42.05,18.8 R23.1
Z: length 16.3
  Top Layer w0.508: U6.3 32.34,23.03 32,23.37 32,27.31 33.96,29.26 U3.4 35.23,29.34 35.81,29.34 36.7,30.23 39.39,30.23 R12.2
$1N691: length 14.6
  Top Layer w0.762: RF1.1 4.95,40.26 -1.34,33.97 C1.1 -0.97,32.01 U1.4
$1N811: length 3.2
  Top Layer w1.143: R8.2 -1,21.61 U1.1
$1N857: length 3.9
  Top Layer w0.762: R1.2 3.23,28.65 U1.3
$1N871: length 11.2
  Top Layer w0.762: K1.6 8.38,29.59 8.25,29.59 5.6,32.24 R1.1 ; R1.1 4.83,34.92 TP1.1 ; R1.1 4.68,32.39 C1.2
$1N1249: length 26.2
  Top Layer w0.762: K1.7 9.87,27.34 10.79,26.42 10.79,24.38 16.9,18.28 R2.1 18.41,17.97 18.41,17.52 19.17,16.76 21.84,16.76 23.05,17.97 C3.2 23.3,18.16 26.29,18.16 26.48,18.35 C2.1
$1N1320: length 4.3
  Top Layer w0.762: R14.1 18.61,29.54 K1.3
$1N1547: length 21.4
  Top Layer w0.762: 23.05,21.97 C3.1 22.93,20.28 R4.2 ; 23.05,21.97 C7.2 22.49,23.87 20.74,25.61 R6.1 18.91,27.34 K1.2 ; 23.05,21.97 23.18,22.1 26.16,22.1 26.48,22.41 C2.2
$1N2253: length 16.3
  Top Layer w0.508: D4.3 TP4.1 33.78,30.73 33.78,31.5 34.42,32.13 35.21,32.13 U2.3
  Top Layer w0.762: R14.2 20.81,29.34 D4.3
$1N6224: length 2.7
  Top Layer w0.762: R6.2 R9.1
$1N6262: length 3.6
  Top Layer w0.762: R4.1 20.39,18.28 19.24,19.43 18.41,19.43 18.1,19.75 R2.2
$1N6325: length 20.2
  Top Layer w0.762: K1.5 10.28,31.74 14.73,36.19 14.73,38.35 16.24,39.86 R3.1 18.94,41.15 21.55,41.15 C4.2
$1N6377: length 3.7
  Top Layer w0.762: R5.1 20.32,39.99 18.2,37.86 R3.2
$1N6535: length 2.9
  Top Layer w0.762: R7.2 R10.1
$1N6629: length 14.3
  Top Layer w0.508: 35.28,34.1 35.98,34.1 U2.4 38.67,32.2 40.13,33.66 TP2.1 42.63,33.66 D1.1 D2.2 43.39,31.37 42.54,31.37 41.89,30.72 R12.1
$1N7875: length 5.4
  Top Layer w0.508: R13.2 53.32,31.75 U4.4 54.37,31.66 R11.1
$1N8016: length 5.3
  Top Layer w0.508: 56.49,31.18 56.79,31.48 R18.2 61.68,31.48 R15.1
$1N17008: length 8.8
  Top Layer w0.381: U10.1 26.18,7.64 C22.2 C21.2 20.29,5.32 L1.2
$1N17602: length 10.2
  Top Layer w0.381: U7.24 61.59,23.72 C15.2 C16.2 67.91,23.86 C14.2
$1N17632: length 10.5
  Top Layer w0.381: U7.22 61.16,22.42 C15.1 C16.1 67.5,21.86 C17.2
$1N20744: length 5.7
  Top Layer w0.381: C18.1 24.64,11.32 24.64,8.51 24.03,7.9 U10.6
$1N20751: length 2.5
  Top Layer w0.381: U10.3 25.92,12.03 C18.2
$1N20802: length 20.4
  Top Layer w0.762: C4.1 22.93,34.23 C9.2 ; C4.1 23.54,38.37 C8.1 ; C4.1 22.71,37.99 R5.2 20.45,36.83 19.81,36.19 18.16,36.19 17.5,35.53 R7.1 17.44,34.84 15.75,33.15 15.75,31.88 15.61,31.74 K1.4
